# Altium schematic sheet IPMC_MACP 3.SchDoc: IPMC Driver
size A2; DrawnBy: YYH; Revision: 1.0; PageSetup: Record=PageOptions|CenterHorizontal=True|CenterVertical=True|PrintScale=0.52|XCorrection=1.00|YCorrection=1.00|PrintKind=0|BorderSize=5000000|LeftOffset=0|BottomOffset=0|Orientation=2|PaperLength=1000|PaperWidth=1000|Scale=100|PaperSource=7|PrintQuality=-3|MediaType=1|DitherType=10|PrintScaleMode=1|PaperKind=A4 210 x 297 毫米¦PaperIndex=9
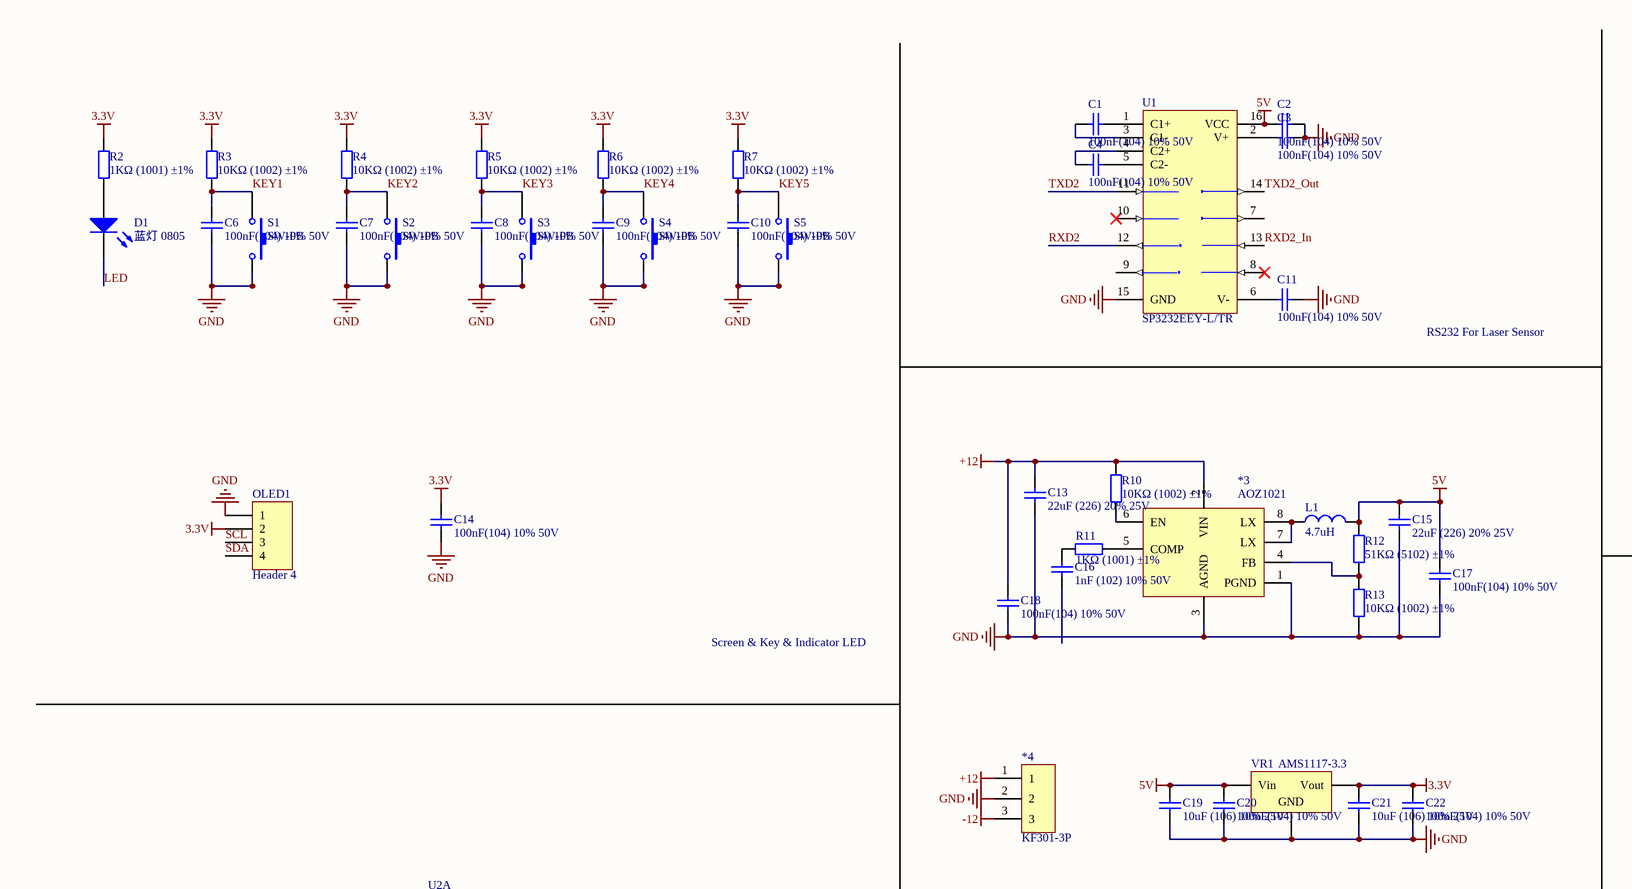
[diagram p0: IPMC_MACP 3.SchDoc, top left]
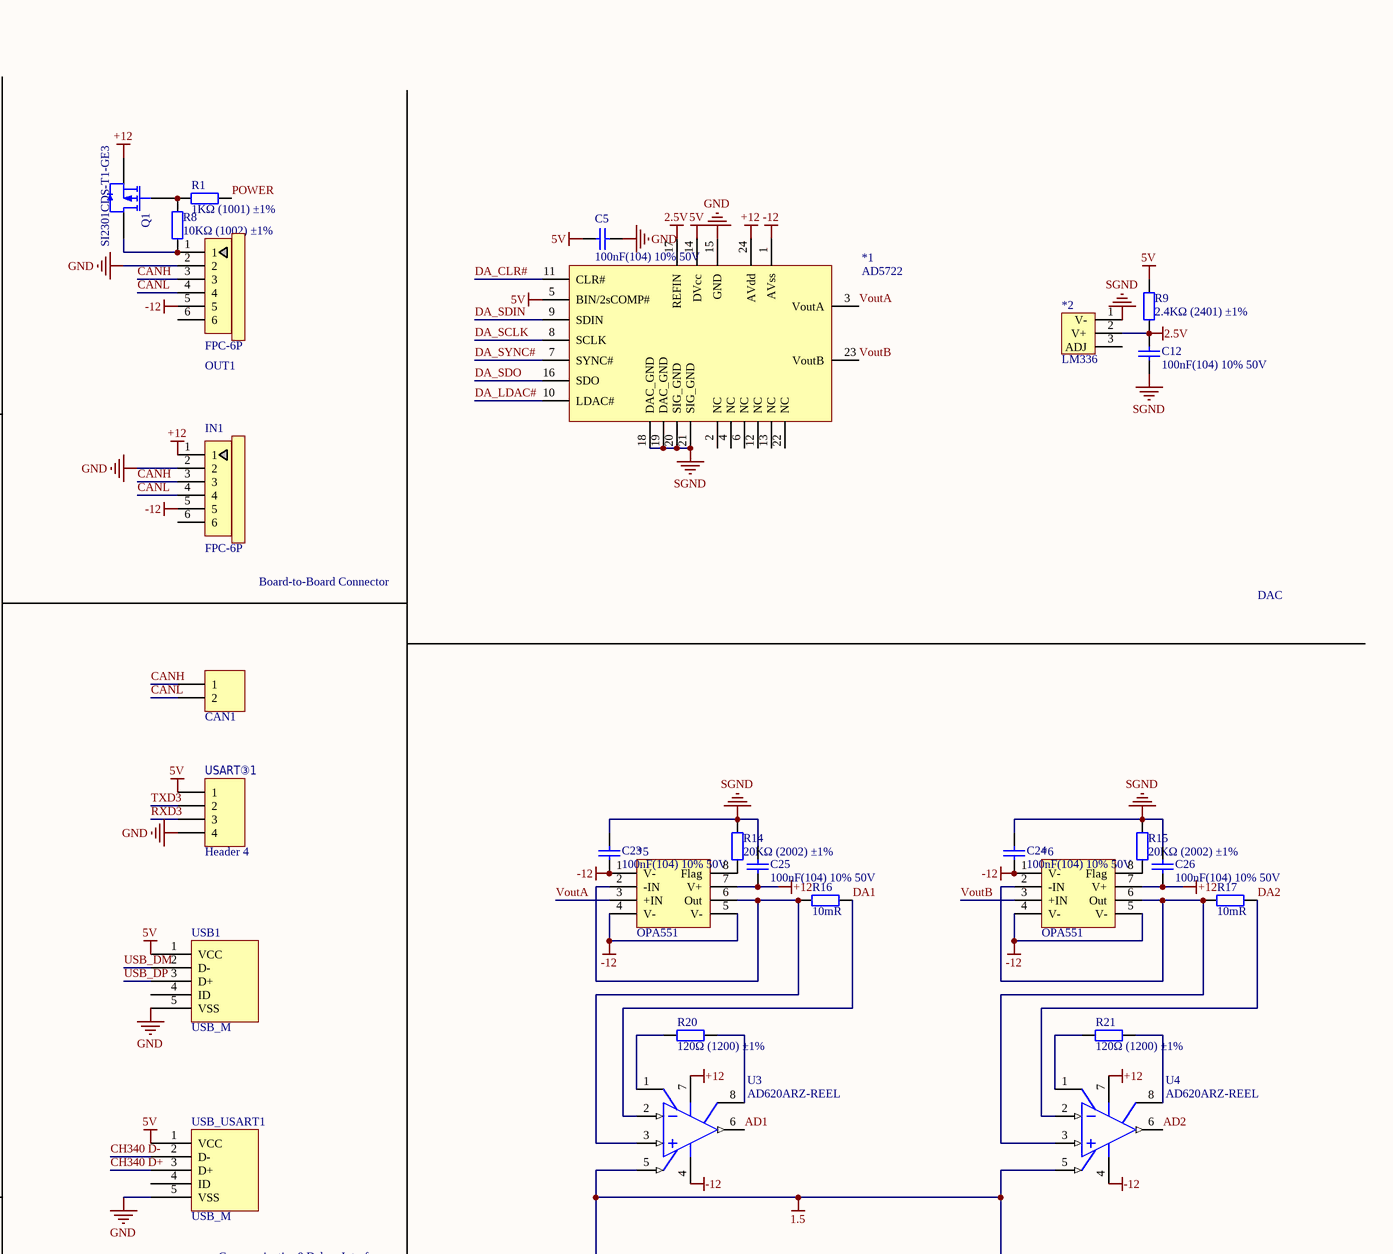
[diagram p1: IPMC_MACP 3.SchDoc, top right]
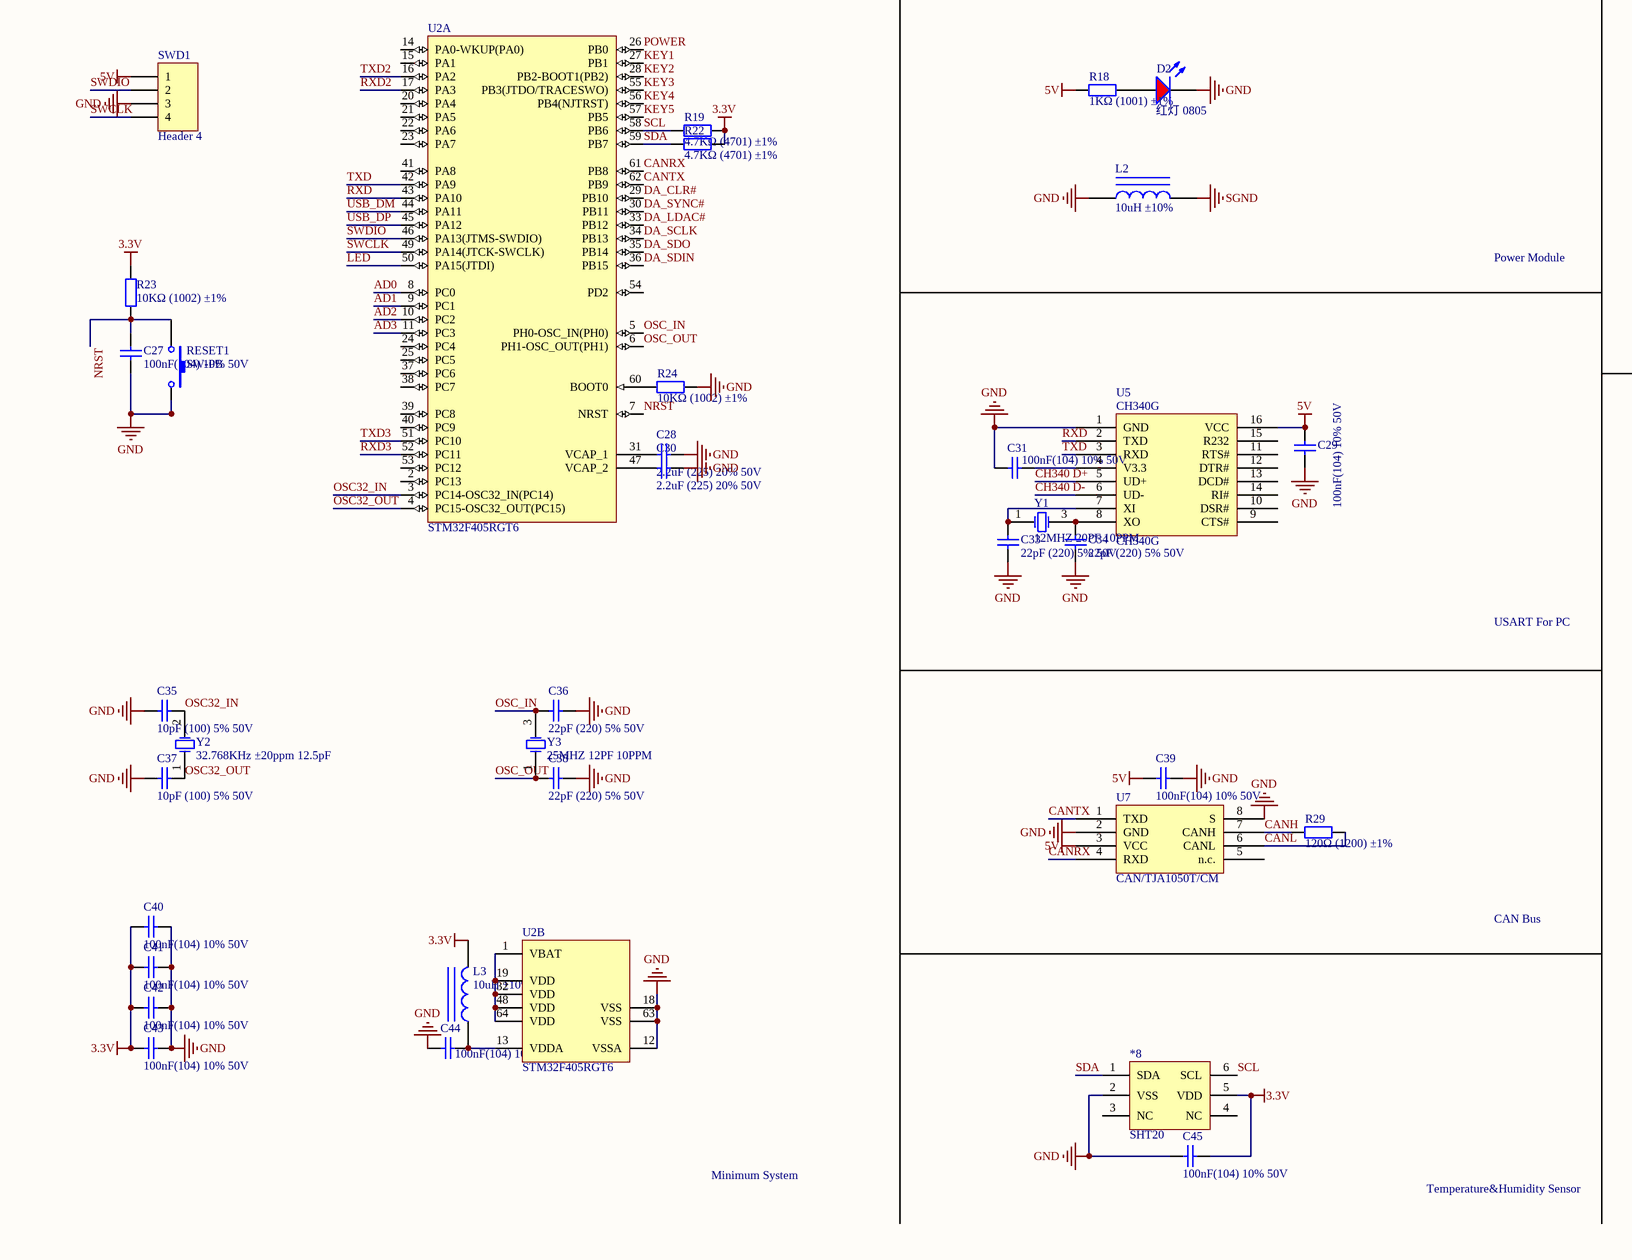
[diagram p2: IPMC_MACP 3.SchDoc, bottom left]
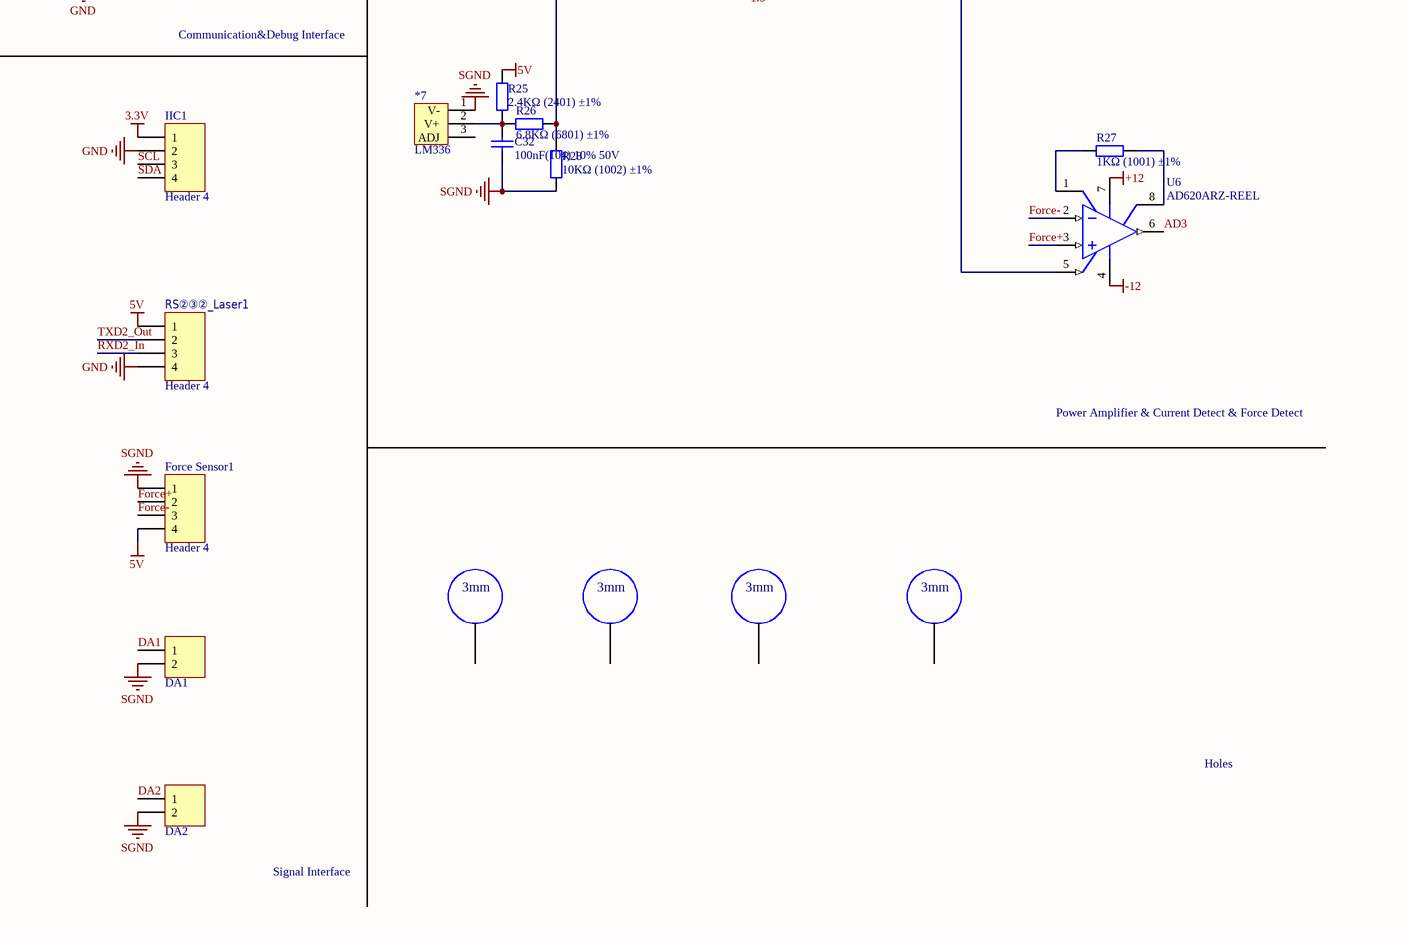
[diagram p3: IPMC_MACP 3.SchDoc, bottom right]

## Parts
*1  AD5722  [TSSOP24P]
*2  LM336  [TO-92A]
*3  AOZ1021  [SOP-8]
*4  KF301-3P  [KF301-3P]
*5  OPA551  [SOIC8_N]
*6  OPA551  [SOIC8_N]
*7  LM336  [TO-92A]
*8  SHT20  [DFN6]
C1  100nF(104) 10% 50V  [0805_C]
C2  100nF(104) 10% 50V  [0805_C]
C3  100nF(104) 10% 50V  [0805_C]
C4  100nF(104) 10% 50V  [0805_C]
C5  100nF(104) 10% 50V  [0805_C]
C6  100nF(104) 10% 50V  [0805_C]
C7  100nF(104) 10% 50V  [0805_C]
C8  100nF(104) 10% 50V  [0805_C]
C9  100nF(104) 10% 50V  [0805_C]
C10  100nF(104) 10% 50V  [0805_C]
C11  100nF(104) 10% 50V  [0805_C]
C12  100nF(104) 10% 50V  [0805_C]
C13  22uF (226) 20% 25V  [0805_C]
C14  100nF(104) 10% 50V  [0805_C]
C15  22uF (226) 20% 25V  [0805_C]
C16  1nF (102) 10% 50V  [0805_C]
C17  100nF(104) 10% 50V  [0805_C]
C18  100nF(104) 10% 50V  [0805_C]
C19  10uF (106) 10% 25V  [0805_C]
C20  100nF(104) 10% 50V  [0805_C]
C21  10uF (106) 10% 25V  [0805_C]
C22  100nF(104) 10% 50V  [0805_C]
C23  100nF(104) 10% 50V  [0805_C]
C24  100nF(104) 10% 50V  [0805_C]
C25  100nF(104) 10% 50V  [0805_C]
C26  100nF(104) 10% 50V  [0805_C]
C27  100nF(104) 10% 50V  [0805_C]
C28  2.2uF (225) 20% 50V  [0805_C]
C29  100nF(104) 10% 50V  [0805_C]
C30  2.2uF (225) 20% 50V  [0805_C]
C31  100nF(104) 10% 50V  [0805_C]
C32  100nF(104) 10% 50V  [0805_C]
C33  22pF (220) 5% 50V  [0805_C]
C34  22pF (220) 5% 50V  [0805_C]
C35  10pF (100) 5% 50V  [0805_C]
C36  22pF (220) 5% 50V  [0805_C]
C37  10pF (100) 5% 50V  [0805_C]
C38  22pF (220) 5% 50V  [0805_C]
C39  100nF(104) 10% 50V  [0805_C]
C40  100nF(104) 10% 50V  [0805_C]
C41  100nF(104) 10% 50V  [0805_C]
C42  100nF(104) 10% 50V  [0805_C]
C43  100nF(104) 10% 50V  [0805_C]
C44  100nF(104) 10% 50V  [0805_C]
C45  100nF(104) 10% 50V  [0805_C]
CAN1  Header 2  [HDR2X1_A]  (value not drawn)
D1  蓝灯 0805  [0805_LED_S1]
D2  红灯 0805  [0805_LED_S1]
DA1  Header 2  [HDR2X1_A]  (value not drawn)
DA2  Header 2  [HDR2X1_A]  (value not drawn)
Force_Sensor1  Header 4  [HDR1X4]
IIC1  Header 4  [HDR1X4]
IN1  FPC-6P  [FPC1.0-6P-A]
L1  4.7uH  [06030]
L2  10uH ±10%  [0805_L]
L3  10uH ±10%  [0805_L]
OLED1  Header 4  [HDR1X4]
OUT1  FPC-6P  [FPC1.0-6P-A]
Q1  SI2301CDS-T1-GE3  [SOT-23(SOT-23-3)]
R1  1KΩ (1001) ±1%  [0805_R]
R2  1KΩ (1001) ±1%  [0805_R]
R3  10KΩ (1002) ±1%  [0805_R]
R4  10KΩ (1002) ±1%  [0805_R]
R5  10KΩ (1002) ±1%  [0805_R]
R6  10KΩ (1002) ±1%  [0805_R]
R7  10KΩ (1002) ±1%  [0805_R]
R8  10KΩ (1002) ±1%  [0805_R]
R9  2.4KΩ (2401) ±1%  [0805_R]
R10  10KΩ (1002) ±1%  [0805_R]
R11  1KΩ (1001) ±1%  [0805_R]
R12  51KΩ (5102) ±1%  [0805_R]
R13  10KΩ (1002) ±1%  [0805_R]
R14  20KΩ (2002) ±1%  [0805_R]
R15  20KΩ (2002) ±1%  [0805_R]
R16  10mR  [2512]
R17  10mR  [2512]
R18  1KΩ (1001) ±1%  [0805_R]
R19  4.7KΩ (4701) ±1%  [0805_R]
R20  120Ω (1200) ±1%  [0805_R]
R21  120Ω (1200) ±1%  [0805_R]
R22  4.7KΩ (4701) ±1%  [0805_R]
R23  10KΩ (1002) ±1%  [0805_R]
R24  10KΩ (1002) ±1%  [0805_R]
R25  2.4KΩ (2401) ±1%  [0805_R]
R26  6.8KΩ (6801) ±1%  [0805_R]
R27  1KΩ (1001) ±1%  [0805_R]
R28  10KΩ (1002) ±1%  [0805_R]
R29  120Ω (1200) ±1%  [0805_R]
RESET1  SW-PB  [SW_PB2_A1]
RS②③②_Laser1  Header 4  [HDR1X4]
S1  SW-PB  [SW_PB2_A1]
S2  SW-PB  [SW_PB2_A1]
S3  SW-PB  [SW_PB2_A1]
S4  SW-PB  [SW_PB2_A1]
S5  SW-PB  [SW_PB2_A1]
SWD1  Header 4  [HDR1X4]
T1  M3铜柱螺丝孔  [螺丝孔-3mm]  (value not drawn)
T2  M3铜柱螺丝孔  [螺丝孔-3mm]  (value not drawn)
T3  M3铜柱螺丝孔  [螺丝孔-3mm]  (value not drawn)
T4  M3铜柱螺丝孔  [螺丝孔-3mm]  (value not drawn)
U1  SP3232EEY-L/TR  [TSSOP-16]
U2  STM32F405RGT6  [STM-LQFP64_L]  (parts A,B of 2)
U3  AD620ARZ-REEL  [SOIC-8_150mil]
U4  AD620ARZ-REEL  [SOIC-8_150mil]
U5  CH340G  [SOIC-16_150mil]
U6  AD620ARZ-REEL  [SOIC-8_150mil]
U7  CAN/TJA1050T/CM  [SOIC-8_150mil]
USART③1  Header 4  [HDR1X4]
USB1  USB_M  [USB_MICRO]
USB_USART1  USB_M  [USB_MICRO]
VR1  AMS1117-3.3  [SOT-223]
Y1  12MHZ 20PF 10PPM  [SMD-3225_4P]
Y2  32.768KHz ±20ppm 12.5pF  [SMD-3215_2P FC - 135]
Y3  25MHZ 12PF 10PPM  [SMD-3225_4P]

## Nets
1.5: R26.2 R28.1 U3.5(REF) U4.5(REF) U6.5(REF)
2.5V: *1.17(REFIN) *2.2(V+) C12.1 R9.1
3.3V: *8.5(VDD) C14.2 C21.2 C22.2 C40.2 C41.2 C42.2 C43.2 C45.2 IIC1.1 L3.2 OLED1.2 R2.1 R3.1 R4.1 R5.1 R6.1 R7.1 R19.2 R22.2 R23.1 VR1.2(Vout)
5V: *1.5(BIN/2sCOMP#) *1.14(DVcc) C2.2 C5.1 C15.2 C17.1 C19.2 C20.2 C29.2 C39.2 Force_Sensor1.4 L1.2 R9.2 R12.2 R18.1 R25.2 RS②③②_Laser1.1 SWD1.1 U1.16(VCC) U5.16(VCC) U7.3(VCC) USART③1.1 USB1.1(VCC) USB_USART1.1(VCC) VR1.3(Vin)
+12: *1.24(AVdd) *3.2(VIN) *4.1 *5.7(V+) *6.7(V+) C13.2 C18.1 C25.1 C26.1 IN1.1 Q1.2(S) R10.1 U3.7(V+) U4.7(V+) U6.7(V+)
-12: *1.1(AVss) *4.3 *5.1(V-) *5.4(V-) *5.5(V-) *6.1(V-) *6.4(V-) *6.5(V-) C23.1 C24.1 IN1.5 OUT1.5 U3.4(V-) U4.4(V-) U6.4(V-)
GND: *1.15(GND) *3.1(PGND) *3.3(AGND) *4.2 *8.2(VSS) C2.1 C3.1 C5.2 C6.2 C7.2 C8.2 C9.2 C10.2 C11.2 C13.1 C14.1 C15.1 C17.2 C18.2 C19.1 C20.1 C21.1 C22.1 C27.2 C28.2 C29.1 C30.2 C31.2 C33.1 C34.1 C35.1 C36.1 C37.1 C38.1 C39.1 C40.1 C41.1 C42.1 C43.1 C44.1 C45.1 D2.K IIC1.2 IN1.2 L2.1 OLED1.1 OUT1.2 R13.1 R24.2 RESET1.2 RS②③②_Laser1.4 S1.2 S2.2 S3.2 S4.2 S5.2 SWD1.3 U1.15(GND) U2.12(VSSA) U2.18(VSS) U2.63(VSS) U5.1(GND) U7.2(GND) U7.8(S) USART③1.4 USB1.5(VSS) USB_USART1.5(VSS) VR1.1(GND)
SGND: *1.18(DAC_GND) *1.19(DAC_GND) *1.20(SIG_GND) *1.21(SIG_GND) *2.1(V-) *7.1(V-) C12.2 C23.2 C24.2 C25.2 C26.2 C32.2 DA1.2 DA2.2 Force_Sensor1.1 L2.2 R14.2 R15.2 R28.2
AD0: U2.8(PC0)
AD1: U2.9(PC1) U3.6(OUT)
AD2: U2.10(PC2) U4.6(OUT)
AD3: U2.11(PC3) U6.6(OUT)
CANH: CAN1.1 IN1.3 OUT1.3 R29.1 U7.7(CANH)
CANL: CAN1.2 IN1.4 OUT1.4 R29.2 U7.6(CANL)
CANRX: U2.61(PB8) U7.4(RXD)
CANTX: U2.62(PB9) U7.1(TXD)
CH340 D+: U5.5(UD+) USB_USART1.3(D+)
CH340 D-: U5.6(UD-) USB_USART1.2(D-)
DA1: DA1.1 R16.2 U3.2(-IN)
DA2: DA2.1 R17.2 U4.2(-IN)
DA_CLR#: *1.11(CLR#) U2.29(PB10)
DA_LDAC#: *1.10(LDAC#) U2.33(PB12)
DA_SCLK: *1.8(SCLK) U2.34(PB13)
DA_SDIN: *1.9(SDIN) U2.36(PB15)
DA_SDO: *1.16(SDO) U2.35(PB14)
DA_SYNC#: *1.7(SYNC#) U2.30(PB11)
Force+: Force_Sensor1.2 U6.3(+IN)
Force-: Force_Sensor1.3 U6.2(-IN)
KEY1: C6.1 R3.2 S1.1 U2.27(PB1)
KEY2: C7.1 R4.2 S2.1 U2.28(PB2-BOOT1(PB2))
KEY3: C8.1 R5.2 S3.1 U2.55(PB3(JTDO/TRACESWO))
KEY4: C9.1 R6.2 S4.1 U2.56(PB4(NJTRST))
KEY5: C10.1 R7.2 S5.1 U2.57(PB5)
LED: D1.K U2.50(PA15(JTDI))
NRST: C27.1 R23.2 RESET1.1 U2.7(NRST)
OSC32_IN: C35.2 U2.3(PC14-OSC32_IN(PC14)) Y2.2(OSC2)
OSC32_OUT: C37.2 U2.4(PC15-OSC32_OUT(PC15)) Y2.1(OSC1)
OSC_IN: C36.2 U2.5(PH0-OSC_IN(PH0)) Y3.3(OSC2)
OSC_OUT: C38.2 U2.6(PH1-OSC_OUT(PH1)) Y3.1(OSC1)
POWER: R1.1 U2.26(PB0)
RXD: U2.43(PA10) U5.2(TXD)
RXD2: U1.12(R1OUT) U2.17(PA3)
RXD2_In: RS②③②_Laser1.3 U1.13(R1IN)
RXD3: U2.52(PC11) USART③1.3
SCL: *8.6(SCL) IIC1.3 OLED1.3 R19.1 U2.58(PB6)
SDA: *8.1(SDA) IIC1.4 OLED1.4 R22.1 U2.59(PB7)
SWCLK: SWD1.4 U2.49(PA14(JTCK-SWCLK))
SWDIO: SWD1.2 U2.46(PA13(JTMS-SWDIO))
TXD: U2.42(PA9) U5.3(RXD)
TXD2: U1.11(T1IN) U2.16(PA2)
TXD2_Out: RS②③②_Laser1.2 U1.14(T1OUT)
TXD3: U2.51(PC10) USART③1.2
USB_DM: U2.44(PA11) USB1.2(D-)
USB_DP: U2.45(PA12) USB1.3(D+)
VoutA: *1.3(VoutA) *5.3(+IN)
VoutB: *1.23(VoutB) *6.3(+IN)
Net*3_4: *3.4(FB) R12.1 R13.2
Net*3_5: *3.5(COMP) R11.1
Net*3_6: *3.6(EN) R10.2
Net*3_7: *3.7(LX) *3.8(LX) L1.1
Net*5_2: *5.2(-IN) *5.6(Out) R16.1 U3.3(+IN)
Net*5_8: *5.8(Flag) R14.1
Net*6_2: *6.2(-IN) *6.6(Out) R17.1 U4.3(+IN)
Net*6_8: *6.8(Flag) R15.1
Net*7_2: *7.2(V+) C32.1 R25.1 R26.1
NetC1_1: C1.1 U1.3(C1-)
NetC1_2: C1.2 U1.1(C1+)
NetC3_2: C3.2 U1.2(V+)
NetC4_1: C4.1 U1.4(C2+)
NetC4_2: C4.2 U1.5(C2-)
NetC11_1: C11.1 U1.6(V-)
NetC16_2: C16.2 R11.2
NetC28_1: C28.1 U2.31(VCAP_1)
NetC30_1: C30.1 U2.47(VCAP_2)
NetC31_1: C31.1 U5.4(V3.3)
NetC33_2: C33.2 U5.7(XI) Y1.1(OSC1)
NetC34_2: C34.2 U5.8(XO) Y1.3(OSC2)
NetC44_2: C44.2 L3.1 U2.13(VDDA)
NetD1_A: D1.A R2.2
NetD2_A: D2.A R18.2
NetOUT1_1: OUT1.1 Q1.3(D) R8.2
NetQ1_1: Q1.1(G) R1.2 R8.1
NetR20_1: R20.1 U3.1(RG)
NetR20_2: R20.2 U3.8(RG)
NetR21_1: R21.1 U4.1(RG)
NetR21_2: R21.2 U4.8(RG)
NetR24_1: R24.1 U2.60(BOOT0)
NetR27_1: R27.1 U6.1(RG)
NetR27_2: R27.2 U6.8(RG)
NetU2_1: U2.1(VBAT) U2.19(VDD) U2.32(VDD) U2.48(VDD) U2.64(VDD)

Not connected (* = marked no-connect by the designer): *1 2(NC) 4(NC) 6(NC) 12(NC) 13(NC) 22(NC); *2 3(ADJ); *7 3(ADJ); *8 3(NC) 4(NC); C16 1; IN1 6; OUT1 6; T1 1; T2 1; T3 1; T4 1; U1 7(T2OUT) 8(R2IN)* 9(R2OUT) 10(T2IN)*; U2 2(PC13) 14(PA0-WKUP(PA0)) 15(PA1) 20(PA4) 21(PA5) 22(PA6) 23(PA7) 24(PC4) 25(PC5) 37(PC6) 38(PC7) 39(PC8) 40(PC9) 41(PA8) 53(PC12) 54(PD2); U5 9(CTS#) 10(DSR#) 11(RTS#) 12(DTR#) 13(DCD#) 14(RI#) 15(R232); U7 5(n.c.); USB1 4(ID); USB_USART1 4(ID)

## Notes on the sheet
- RS232 For Laser Sensor
- Board-to-Board Connector
- DAC
- Screen & Key & Indicator LED
- Power Module
- Communication&Debug Interface
- USART For PC
- Power Amplifier & Current Detect & Force Detect
- CAN Bus
- Holes
- Minimum System
- Temperature&Humidity Sensor
- Signal Interface
- (in symbol M3铜柱螺丝孔) 3mm

## Library data of the parts
*1 = AD5722: 双极性DAC
*2 *7 = LM336: 基准电压芯片2.5/5V
*3 = AOZ1021: 3A开关电源芯片
*4 = KF301-3P: 蓝色端子
*5 *6 = OPA551: 高电压大电流运算放大器
C1-C12 C14 C17 C18 C20 C22-C27 C29 C31 C32 C39-C45 = 0805 100nF(104) 10% 50V: 贴片电容; ComponentLink1Description: 供应商链接; ComponentLink1URL: http://www.szlcsc.com/product/details_50686.html; Package: 0805; Supplier: LC; SuppliersPartNumber: C49678
C13 C15 = 0805 22uF (226) 20% 25V: 贴片电容; ComponentLink1Description: 供应商链接; ComponentLink1URL: http://www.szlcsc.com/product/details_46786.html; Package: 0805; Supplier: LC; SuppliersPartNumber: C45783
C16 = 0805 1nF (102) 10% 50V: 贴片电容; ComponentLink1Description: 供应商链接; ComponentLink1URL: http://www.szlcsc.com/product/details_52223.html; Package: 0805; Supplier: LC; SuppliersPartNumber: C51210
C19 C21 = 0805 10uF (106) 10% 25V: 贴片电容; ComponentLink1Description: 供应商链接; ComponentLink1URL: http://www.szlcsc.com/product/details_16532.html; Package: 0805; Supplier: LC; SuppliersPartNumber: C15850
C28 C30 = 0805 2.2uF (225) 20% 50V: 贴片电容; ComponentLink1Description: 供应商链接; ComponentLink1URL: http://www.szlcsc.com/product/details_50225.html; Package: 0805; Supplier: LC; SuppliersPartNumber: C49217
C33 C34 C36 C38 = 0805 22pF (220) 5% 50V: 贴片电容; ComponentLink1Description: 供应商链接; ComponentLink1URL: http://www.szlcsc.com/product/details_2156.html; Package: 0805; Supplier: LC; SuppliersPartNumber: C1804
C35 C37 = 0805 10pF (100) 5% 50V: 贴片电容; ComponentLink1Description: 供应商链接; ComponentLink1URL: http://www.szlcsc.com/product/details_2137.html; Package: 0805; Supplier: LC; SuppliersPartNumber: C1785
CAN1 DA1 DA2 = Header 2: 接插件; LatestRevisionDate: 17-Jul-2002; LatestRevisionNote: Re-released for DXP Platform.; Publisher: Altium Limited
D1 = 0805 蓝灯: 发光二极管; ComponentLink1Description: 供应商链接; ComponentLink1URL: http://www.szlcsc.com/product/details_2666.html; Package: 0805; Supplier: LC; SuppliersPartNumber: C2293
D2 = 0805 红灯: 发光二极管; ComponentLink1Description: 供应商链接; ComponentLink1URL: http://www.szlcsc.com/product/details_2668.html; Package: 0805; Supplier: LC; SuppliersPartNumber: C2295
Force_Sensor1 IIC1 OLED1 RS②③②_Laser1 SWD1 USART③1 = Header 4: Header, 4-Pin; LatestRevisionDate: 17-Jul-2002; LatestRevisionNote: Re-released for DXP Platform.; Publisher: Altium Limited
IN1 OUT1 = FPC-6P: FPC排线连接器
L1 = Inductor: 电感; Code_IEC: 1005; Published: 8-Jun-2000; LatestRevisionDate: 17-Jul-2002; LatestRevisionNote: Re-released for DXP Platform.; PackageReference: 0402-A; Publisher: Altium Limited; Code_JEITA: 0402
L2 L3 = 0805 10uH 10%: 贴片电感; ComponentLink1Description: 供应商链接; ComponentLink1URL: http://www.szlcsc.com/product/details_1398.html; Package: 0805; Supplier: LC; SuppliersPartNumber: C1046
Q1 = SI2301CDS-T1-GE3: MOS(场效应管); ComponentLink1Description: 供应商链接; ComponentLink1URL: http://www.szlcsc.com/product/details_11030.html; Package: SOT-23(SOT-23-3); Supplier: LC; SuppliersPartNumber: C10487
R1 R2 R11 R18 R27 = 0805 1KΩ (1001) 1%: 贴片电阻; ComponentLink1Description: 供应商链接; ComponentLink1URL: http://www.szlcsc.com/product/details_18201.html; Package: 0805; Supplier: LC; SuppliersPartNumber: C17513
R3-R8 R10 R13 R23 R24 R28 = 0805 10KΩ (1002) 1%: 贴片电阻; ComponentLink1Description: 供应商链接; ComponentLink1URL: http://www.szlcsc.com/product/details_18102.html; Package: 0805; Supplier: LC; SuppliersPartNumber: C17414
R9 R25 = 0805 2.4KΩ (2401) 1%: 贴片电阻; ComponentLink1Description: 供应商链接; ComponentLink1URL: http://www.szlcsc.com/product/details_18214.html; Package: 0805; Supplier: LC; SuppliersPartNumber: C17526
R12 = 0805 51KΩ (5102) 1%: 贴片电阻; ComponentLink1Description: 供应商链接; ComponentLink1URL: http://www.szlcsc.com/product/details_18425.html; Package: 0805; Supplier: LC; SuppliersPartNumber: C17737
R14 R15 = 0805 20KΩ (2002) 1%: 贴片电阻; ComponentLink1Description: 供应商链接; ComponentLink1URL: http://www.szlcsc.com/product/details_4735.html; Package: 0805; Supplier: LC; SuppliersPartNumber: C4328
R16 R17 = Res1: 贴片电阻; Published: 8-Jun-2000; LatestRevisionDate: 17-Jul-2002; LatestRevisionNote: Re-released for DXP Platform.; PackageReference: AXIAL-0.4; Publisher: Altium Limited
R19 R22 = 0805 4.7KΩ (4701) 1%: 贴片电阻; ComponentLink1Description: 供应商链接; ComponentLink1URL: http://www.szlcsc.com/product/details_18361.html; Package: 0805; Supplier: LC; SuppliersPartNumber: C17673
R20 R21 R29 = 0805 120Ω (1200) 1%: 贴片电阻; ComponentLink1Description: 供应商链接; ComponentLink1URL: http://www.szlcsc.com/product/details_18125.html; Package: 0805; Supplier: LC; SuppliersPartNumber: C17437
R26 = 0805 6.8KΩ (6801) 1%: 贴片电阻; ComponentLink1Description: 供应商链接; ComponentLink1URL: http://www.szlcsc.com/product/details_18460.html; Package: 0805; Supplier: LC; SuppliersPartNumber: C17772
RESET1 S1-S5 = SW-PB: 微动开关; Published: 24-Mar-1999; LatestRevisionDate: 17-Jul-2002; LatestRevisionNote: Re-released for DXP Platform.; PackageReference: SPST-2; Publisher: Altium Limited
U1 = SP3232EEY-L/TR: RS232; ComponentLink1Description: 供应商链接; ComponentLink1URL: http://www.szlcsc.com/product/details_14131.html; Package: TSSOP-16; Supplier: LC; SuppliersPartNumber: C13482
U2 = STM32F405RGT6: ARM Cortex-M4 32-bit MCU+FPU, 210 DMIPS, 1024 kB Flash, 192 kB Internal RAM, 51 I/Os, 64-pin LQFP, -40 to 85 degC, Tray; Manufacturer: STMicroelectronics; D/A Converter: 2x12-bit; FLASH Size (Prog) (kB): 1024; I/Os (High Current): 51; Internal RAM Size (kB): 192; Operating Frequency(F) (Processor speed) (MHz): 168; Supply Voltage(Vcc) max (V): 3.6; Supply Voltage(Vcc) min (V): 1.8; DatasheetVersion: Rev. 4; PackageVersion: Rev. 4, 06/2013; PackageReference: LQFP64; PackageDescription: 64-Pin Low Profile Quad Flat Package, 10 x 10 mm Body, 0.5 mm Pitch; Supplier 1: Digi-Key; Supplier Part Number 1: 497-11767-ND; Supplier 2: Farnell; Supplier Part Number 2: 2064363; Supplier 3: Newark; Supplier Part Number 3: 73T2329; Supplier 4: Mouser; Supplier Part Number 4: 511-STM32F405RGT6; Core: ARM Cortex-M4; Packing: Tray; Mounting Technology: Surface Mount; PartNumber: STM32F405RGT6; ComponentLink1Description: Manufacturer URL; ComponentLink1URL: http://www.st.com/web/en/home.html; ComponentLink2Description: Datasheet; ComponentLink2URL: http://www.st.com/st-web-ui/static/active/en/resource/technical/document/datasheet/DM00037051.pdf; ComponentLink3Description: Package Specification; ComponentLink3URL: http://www.st.com/st-web-ui/static/active/en/resource/technical/document/datasheet/DM00037051.pdf
U3 U4 U6 = AD620ARZ-REEL: 仪放; ComponentLink1Description: 供应商链接; ComponentLink1URL: http://www.szlcsc.com/product/details_10205.html; Package: SOIC-8_150mil; Supplier: LC; SuppliersPartNumber: C9675
U5 = CH340G: USB; ComponentLink1Description: 供应商链接; ComponentLink1URL: http://www.szlcsc.com/product/details_14927.html; Package: SOIC-16_150mil; Supplier: LC; SuppliersPartNumber: C14267
U7 = CAN/TJA1050T/CM: CAN; ComponentLink1Description: 供应商链接; ComponentLink1URL: http://www.szlcsc.com/product/details_7424.html; Package: SOIC-8_150mil; Supplier: LC; SuppliersPartNumber: C6952
USB1 USB_USART1 = USB_M: MicroUSB接口
VR1 = SOT-223 AMS1117-3.3: 低压差线性稳压(LDO); ComponentLink1Description: 供应商链接; ComponentLink1URL: http://www.szlcsc.com/product/details_6652.html; Package: SOT-223; Supplier: LC; SuppliersPartNumber: C6186
Y1 = SMD-3225_4P  12MHZ 20PF 10PPM: 贴片晶振; ComponentLink1Description: 供应商链接; ComponentLink1URL: http://www.szlcsc.com/product/details_9522.html; Package: SMD-3225_4P; Supplier: LC; SuppliersPartNumber: C9002
Y2 = SMD-3215_2P 32.768KHz 20ppm 12.5pF: 贴片晶振; ComponentLink1Description: 供应商链接; ComponentLink1URL: http://www.szlcsc.com/product/details_33310.html; Package: SMD-3215_2P; Supplier: LC; SuppliersPartNumber: C32346
Y3 = SMD-3225_4P  25MHZ 12PF 10PPM: 贴片晶振; ComponentLink1Description: 供应商链接; ComponentLink1URL: http://www.szlcsc.com/product/details_9526.html; Package: SMD-3225_4P; Supplier: LC; SuppliersPartNumber: C9006